# Altium schematic sheet MPPT CC CV charger (A).SchDoc
size A4; SheetNumber: 3; SheetTotal: 10
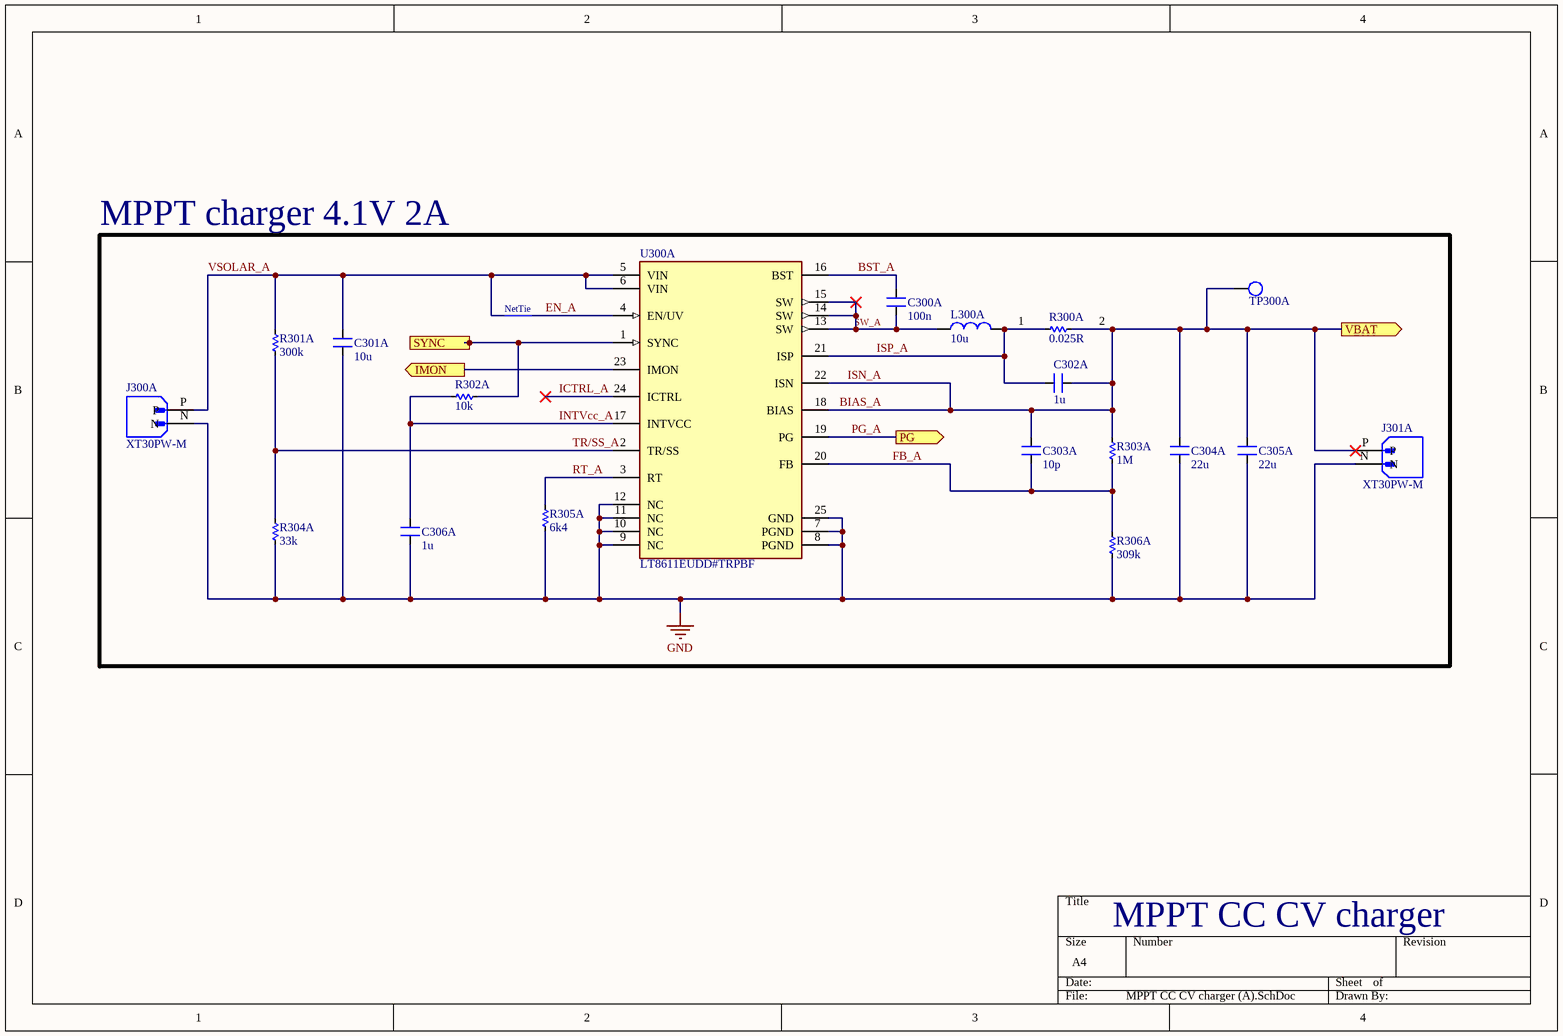
[diagram p0: MPPT CC CV charger (A).SchDoc]

## Parts
C300A  100n  [CN-SMD-0603]
C301A  10u  [CN-SMD-0603]
C302A  1u  [CN-SMD-0603]
C303A  10p  [CN-SMD-0603]
C304A  22u  [CN-SMD-0603]
C305A  22u  [CN-SMD-0603]
C306A  1u  [CN-SMD-0603]
J300A  XT30PW-M  [AMASS_XT30PW-M]
J301A  XT30PW-M  [AMASS_XT30PW-M]
L300A  10u  [L-SMD-M-7.3x4.5]
R300A  0.025R  [RES-SMD-0603]
R301A  300k  [RES-SMD-0603]
R302A  10k  [RES-SMD-0603]
R303A  1M  [RES-SMD-0603]
R304A  33k  [RES-SMD-0603]
R305A  6k4  [RES-SMD-0603]
R306A  309k  [RES-SMD-0603]
TP300A  Test-Point  [TESTPOINT]  (value not drawn)
U300A  LT8611EUDD#TRPBF  [FP-UDD-24-05-08-1833-IPC_B]

## Ports
IMON (out, see BD[1B]), PG (out, see BD[1A]), SYNC (in, see BD[1B]), VBAT (out, see BD[1A])

## Nets
GND: C301A.1 C304A.1 C305A.1 C306A.1 J300A.N J301A.N R304A.1 R305A.1 R306A.2 U300A.7(PGND) U300A.8(PGND) U300A.9(NC) U300A.10(NC) U300A.11(NC) U300A.12(NC) U300A.25(GND)
BIAS_A: C302A.2 C303A.2 C304A.2 C305A.2 J301A.P R300A.1 R303A.1 TP300A.1 U300A.18(BIAS) U300A.22(ISN) ; port VBAT  [also labelled ISN_A]
BST_A: C300A.2 U300A.16(BST)
EN_A: C301A.2 J300A.P R301A.2 U300A.4(EN/UV) U300A.5(VIN) U300A.6(VIN)  [also labelled VSOLAR_A]
FB_A: C303A.1 R303A.2 R306A.1 U300A.20(FB)
ICTRL_A: U300A.24(ICTRL)
IMON: U300A.23(IMON) ; port IMON
INTVcc_A: C306A.2 R302A.2 U300A.17(INTVCC)
ISP_A: C302A.1 L300A.2 R300A.2 U300A.21(ISP)
PG_A: U300A.19(PG) ; port PG
RT_A: R305A.2 U300A.3(RT)
SW_A: C300A.1 L300A.1 U300A.13(SW) U300A.14(SW) U300A.15(SW)
SYNC: R302A.1 U300A.1(SYNC) ; port SYNC
TR/SS_A: R301A.1 R304A.2 U300A.2(TR/SS)

## Notes on the sheet
- MPPT charger 4.1V 2A
- NetTie
- 1
- (near R300A) 2
- MPPT CC CV charger

## Library data of the parts
C300A C301A C302A C303A C304A C305A C306A = CN: Value: 33pF
J300A J301A = XT30PW-M: Socket; DC supply; XT30; male; PIN: 2; on PCBs; THT; Colour: yellow; MF: AMASS; SnapEDA_Link: https://www.snapeda.com/parts/XT30PW-M/AMASS/view-part/?ref=snap; Package: None; Value: *; MP: XT30PW-M; Check_prices: https://www.snapeda.com/parts/XT30PW-M/AMASS/view-part/?ref=eda
L300A = L-SMD-1: partNo: 78477010; Manufacturer: Wurth Elektronik; Inductance: 1.0 μH; ComponentLink1Description: Manufacturer; ComponentLink1URL: http://www.we-online.de; Created by: Baojun Chen; Created Date: Nov.2015; ComponentLink2Description: Datasheet; ComponentLink2URL: http://katalog.we-online.de/pbs/datasheet/78477010.pdf
R300A R301A R302A R303A R304A R305A R306A = Res-SMD: Resistor; Manufacturer: Generic Components; Class: Passive; Published: 08/06/2000; Publisher: Altium Hobart Technology Centre
U300A = CMP-0491-02169-2: IC REG BUCK ADJ 2.5A 24QFN; Synchronous Rectifier: Yes; Number of Outputs: 1; Output Type: Adjustable; Switching Frequency: 2MHz; Efficiency: 96%; Output Voltage: 40V; Max Operating Temperature: 125°C; Output Current: 2.5A; RoHS Compliant: Yes; Case/Package: QFN; Package Quantity: 2500; Lead Free: Lead Free; Series: -; Number of Pins: 24; Min Operating Temperature: -40°C; Packaging: Tape and Reel